# EAGLE design syncbox (EAGLE 9.2.2)
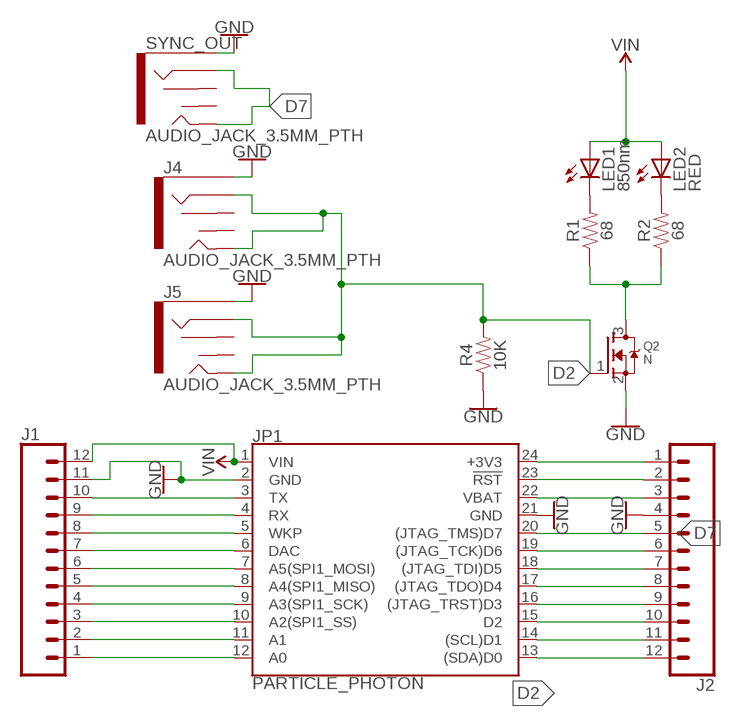
[diagram p0: schematic, sheet 1]

## Parts
J1  CONN_12  [1X12]
J2  CONN_12  [1X12]
J4  AUDIO_JACK_3.5MM_PTH  [AUDIO-JACK]
J5  AUDIO_JACK_3.5MM_PTH  [AUDIO-JACK]
JP1  PARTICLE_PHOTON  [PARTICLE_PHOTON]
LED1  850nm  LED5MM  [LED5MM]
LED2  RED  LED5MM  [LED5MM]
Q2  N  MOSFET-NWAVE  [SOT23-W]
R1  68  RESISTORAXIAL-0.3  [AXIAL-0.3]
R2  68  RESISTORAXIAL-0.3  [AXIAL-0.3]
R4  10K  RESISTORAXIAL-0.3  [AXIAL-0.3]
SYNC_OUT  AUDIO_JACK_3.5MM_PTH  [AUDIO-JACK]

## Nets
D2: J2.10 J4.RING J4.TIP J5.RING J5.TIP JP1.15(D2) Q2.1(G) R4.P$2
D7: J2.5 JP1.20((JTAG_TMS)D7) SYNC_OUT.RING SYNC_OUT.TIP
GND: J1.11 J2.4 J4.SLEEVE J5.SLEEVE JP1.2(GND) JP1.21(GND) Q2.2(S) R4.P$1 SYNC_OUT.SLEEVE
N$1: LED1.K(C) R1.P$2
N$2: LED2.K(C) R2.P$2
N$3: Q2.3(D) R1.P$1 R2.P$1
N$4: J1.10 JP1.3(TX)
N$5: J1.9 JP1.4(RX)
N$6: J2.12 JP1.13((SDA)D0)
N$7: J1.8 JP1.5(WKP)
N$8: J1.7 JP1.6(DAC)
N$9: J1.6 JP1.7(A5(SPI1_MOSI))
N$10: J1.5 JP1.8(A4(SPI1_MISO))
N$11: J1.4 JP1.9(A3(SPI1_SCK))
N$12: J1.3 JP1.10(A2(SPI1_SS))
N$13: J1.2 JP1.11(A1)
N$14: J1.1 JP1.12(A0)
N$15: J2.11 JP1.14((SCL)D1)
N$16: J2.9 JP1.16((JTAG_TRST)D3)
N$17: J2.8 JP1.17((JTAG_TDO)D4)
N$18: J2.7 JP1.18((JTAG_TDI)D5)
N$19: J2.6 JP1.19((JTAG_TCK)D6)
N$22: J2.3 JP1.22(VBAT)
N$23: J2.2 JP1.23(!RST!)
N$24: J2.1 JP1.24(+3V3)
VIN: J1.12 JP1.1(VIN) LED1.A LED2.A
Unconnected: J4.RSH J4.TSH J5.RSH J5.TSH SYNC_OUT.RSH SYNC_OUT.TSH

## Library data of the parts
J1 J2 = SparkFun-Connectors:CONN_12: Multi connection point. Often used as Generic Header-pin footprint for 0.1 inch spaced/style header connections On any of the 0.1 inch spaced packages, you can populate with these: Break Away Headers - Straight <https://www.sparkfun.com/products/116> (PRT-00116) Break Away Male Headers - Right Angle <https://www.sparkfun.com/products/553> (PRT-00553) Female Headers <https://www.sparkfun.com/products/115> (PRT-00115) Break Away Headers - Machine Pin <https://www.sparkfun.com/products/117> (PRT-00117) Break Away Female Headers - Swiss Machine Pin <https://www.sparkfun.com/products/743> (PRT-00743) For SCREWTERMINALS and SPRING TERMINALS visit here: Screw Terimnals on SparkFun.com <https://www.sparkfun.com/search/results?term=Screw+Terminals> (5mm/3.5mm/2.54mm spacing) This device is also useful as a general connection point to wire up your design to another part of your project. Our various solder wires solder well into these plated through hole pads. Hook-Up Wire - Assortment (Stranded, 22 AWG) <https://www.sparkfun.com/products/11375> (PRT-11375) Hook-Up Wire - Assortment (Solid Core, 22 AWG) <https://www.sparkfun.com/products/11367> (PRT-11367) View the entire wire category on our website here <https://www.sparkfun.com/categories/141> Special notes: Molex polarized connector foot print use with SKU : PRT-08231 with associated crimp pins and housings. 1MM SMD Version SKU: PRT-10208 NOTES ON THE VARIANTS LOCK and LOCK_LONGPADS... This footprint was designed to help hold the alignment of a through-hole component (i.e. 6-pin header) while soldering it into place. You may notice that each hole has been shifted either up or down by 0.005 of an inch from it's more standard position (which is a perfectly straight line). This slight alteration caused the pins (the squares in the middle) to touch the edges of the holes. Because they are alternating, it causes a "brace" to hold the component in place. 0.005 has proven to be the perfect amount of "off-center" position when using our standard breakaway headers. Although looks a little odd when you look at the bare footprint, once you have a header in there, the alteration is very hard to notice. Also,if you push a header all the way into place, it is covered up entirely on the bottom side.
J4 J5 SYNC_OUT = SparkFun-Connectors:AUDIO_JACK_3.5MM: Audio Jack 3.5mm variants of PTH and SMT stereo audio jack with bypass switches. SparkFun Products: SparkFun SparkPunk Sound Kit <[https://www.sparkfun.com/products/11177]> - PTH MP3 Trigger <https://www.sparkfun.com/products/13720> -3.5mm SMD SparkFun PicoBoard <https://www.sparkfun.com/products/11888>- 2.5mm SMD; PROD_ID: CONN-08774; SF_ID: PRT-08032
JP1 = SparkFun-Boards:PARTICLE_PHOTON: Particle Photon Footprint of the Particle Photon that is used as a basis for many Photon shields. SparkFun Products: Particle Photon <https://www.sparkfun.com/products/13764> SparkFun Photon ProtoShield <https://www.sparkfun.com/products/13598> SparkFun Photon micro OLED Shield <https://www.sparkfun.com/products/13628> SparkFun Photon IMU Shield <https://www.sparkfun.com/products/13629> SparkFun Photon Battery Shield <https://www.sparkfun.com/products/13626>
LED1 LED2 = adafruit:LED: LED OSRAM: - CHIPLED LG R971, LG N971, LY N971, LG Q971, LY Q971, LO R971, LY R971 LH N974, LH R974 LS Q976, LO Q976, LY Q976 LO Q996 - Hyper CHIPLED LW Q18S LB Q993, LB Q99A, LB R99A - SideLED LS A670, LO A670, LY A670, LG A670, LP A670 LB A673, LV A673, LT A673, LW A673 LH A674 LY A675 LS A676, LA A676, LO A676, LY A676, LW A676 LS A679, LY A679, LG A679 - Hyper Micro SIDELED® LS Y876, LA Y876, LO Y876, LY Y876 LT Y87S - SmartLED LW L88C, LW L88S LB L89C, LB L89S, LG L890 LS L89K, LO L89K, LY L89K LS L896, LA L896, LO L896, LY L896 - TOPLED LS T670, LO T670, LY T670, LG T670, LP T670 LSG T670, LSP T670, LSY T670, LOP T670, LYG T670 LG T671, LOG T671, LSG T671 LB T673, LV T673, LT T673, LW T673 LH T674 LS T676, LA T676, LO T676, LY T676, LB T676, LH T676, LSB T676, LW T676 LB T67C, LV T67C, LT T67C, LS T67K, LO T67K, LY T67K, LW E67C LS E67B, LA E67B, LO E67B, LY E67B, LB E67C, LV E67C, LT E67C LW T67C LS T679, LY T679, LG T679 LS T770, LO T770, LY T770, LG T770, LP T770 LB T773, LV T773, LT T773, LW T773 LH T774 LS E675, LA E675, LY E675, LS T675 LS T776, LA T776, LO T776, LY T776, LB T776 LHGB T686 LT T68C, LB T68C - Hyper Mini TOPLED® LB M676 - Mini TOPLED Santana® LG M470 LS M47K, LO M47K, LY M47K Source: http://www.osram.convergy.de/
Q2 = adafruit:MOSFET-N: N-Channel Mosfet 2N7002E - 60V 260mA SOT23 [Digikey: 2N7002ET1GOSTR-ND] - REEL BSH103 - 30V 850mA SOT23 [Digikey: 568-5013-1-ND]
R1 R2 R4 = SparkFun-Resistors:RESISTOR: Generic Resistor Package

## Net classes
0 default: width 0.254 mm

## Board
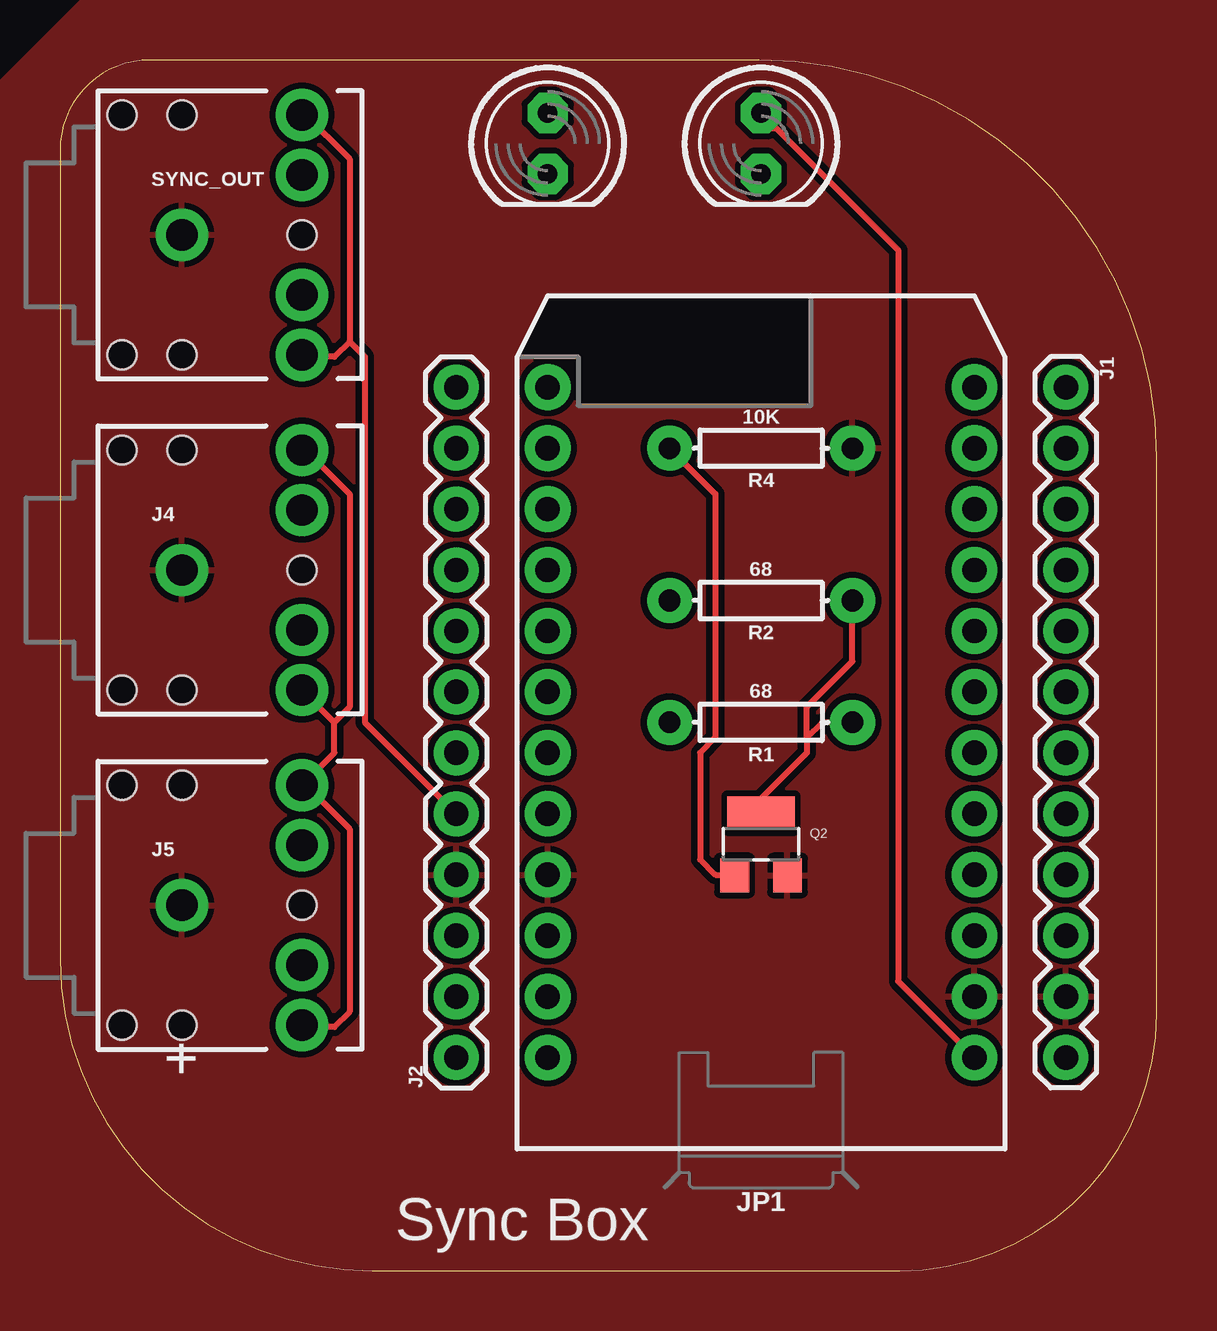
[diagram p1: board, top side]
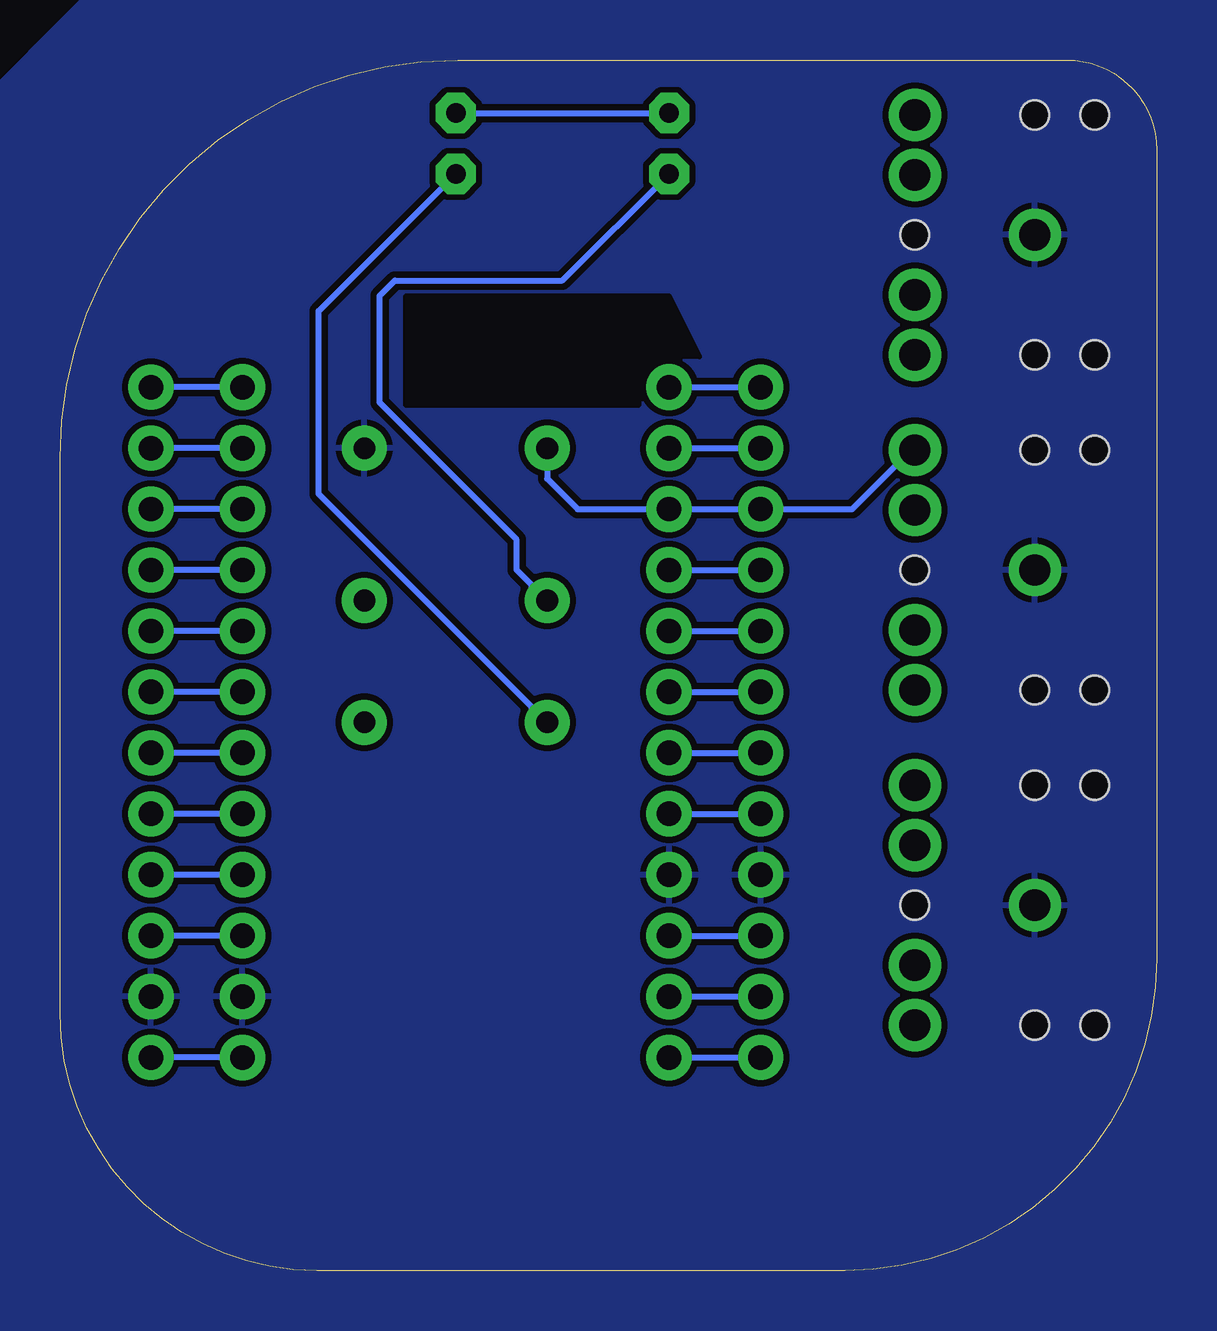
[diagram p2: board, bottom side, seen from below]

Size 45.7 x 50.47 mm. Coordinates in mm from the lower left corner, seen from the top.
Outline: 45.7,10.72 45.7,33.91 arc90 29.14,50.47 3.76,50.47 arc90 0,46.72 0,13.01 arc90 13.01,0 34.98,0 arc90 45.7,10.72
Copper layers (1*16): Top 0.035mm / dielectric 1.5mm / Bottom 0.035mm
Design rules "Voltera_DRC": minimum track width 10mil, minimum drill 0.6mm, track to track 10mil, track to pad 10mil, pad to pad 0.6mm, via to via 0.6mm, smd to smd 0mil, copper to edge 0mil, drill to drill 0.8mm, minimum pad ring 0.2mm, minimum via ring 0.2mm, stop-mask expansion 4mil, vias tented up to drill 0mil, thermal gap 10mil

### Footprints (pad centres in the part's own frame; a part is rotated, then mirrored left to right if it is on the bottom)
1X12 = drill 1.016 pad 1.88: 1 0,0; 2 2.54,0; 3 5.08,0; 4 7.62,0; 5 10.16,0; 6 12.7,0; 7 15.24,0; 8 17.78,0; 9 20.32,0; 10 22.86,0; 11 25.4,0; 12 27.94,0
AUDIO-JACK = drill 1.3 pad 2.184: RING 5,5; RSH 5,2.5; SLEEVE 0,0; TIP 5,-5; TSH 5,-2.5 | hole 1.2: 0,5; -2.5,5; -2.5,-5; 0,-5; 5,0
PARTICLE_PHOTON = drill 1.016 pad 1.905: 1 -8.89,13.97; 2 -8.89,11.43; 3 -8.89,8.89; 4 -8.89,6.35; 5 -8.89,3.81; 6 -8.89,1.27; 7 -8.89,-1.27; 8 -8.89,-3.81; 9 -8.89,-6.35; 10 -8.89,-8.89; 11 -8.89,-11.43; 12 -8.89,-13.97; 13 8.89,-13.97; 14 8.89,-11.43; 15 8.89,-8.89; 16 8.89,-6.35; 17 8.89,-3.81; 18 8.89,-1.27; 19 8.89,1.27; 20 8.89,3.81; 21 8.89,6.35; 22 8.89,8.89; 23 8.89,11.43; 24 8.89,13.97
LED5MM = drill 0.813 pad 1.676 octagon: A -1.27,0; K 1.27,0
SOT23-W = smd 1.2 x 1.4: 1 -1.1,-1.3; 2 1.1,-1.3 | smd 2.8 x 1.4: 3 0,1.3
AXIAL-0.3 = drill 0.9 pad 1.88: P$1 -3.81,0; P$2 3.81,0

### Placement (x,y rotation side)
J1  41.91,36.83 270 top
J2  16.51,8.89 90 top
J4  5.08,29.21 0 top
J5  5.08,15.24 0 top
JP1  29.21,22.86 180 top
LED1  29.21,46.99 270 top
LED2  20.32,46.99 270 top
Q2  29.21,17.78 0 top
R1  29.21,22.86 180 top
R2  29.21,27.94 180 top
R4  29.21,34.29 180 top
SYNC_OUT  5.08,43.18 0 top

### Tracks (layer width: path | path; a pad name or v marks a point on that pad's centre or on a via)
D2
  Top 0.254: 10.79,19.68 10.16,20.32 J5.RING 10.79,19.68 | 10.79,19.68 12.06,18.41 12.06,10.79 11.43,10.16 10.16,10.16 J5.TIP | 11.43,22.86 J4.TIP | 11.43,22.86 11.43,21.59 10.79,20.95 10.79,19.68 | R4.P$2 25.4,33.66 26.03,33.66 27.3,32.38 27.3,22.22 26.67,21.59 26.67,17.14 27.3,16.51 27.94,16.51 Q2.1 | 11.43,22.86 12.06,23.49 12.06,32.38 10.16,34.29 J4.RING
  Bottom 0.254: J4.RING 10.16,33.66 10.79,33.66 12.7,31.75 J2.10 JP1.15 24.13,31.75 25.4,33.02 R4.P$2
D7
  Top 0.254: 12.06,38.73 11.43,38.1 10.16,38.1 SYNC_OUT.TIP | 12.06,38.73 12.06,46.36 10.16,48.26 SYNC_OUT.RING | J2.5 12.7,22.86 12.7,38.1 12.06,38.73
  Bottom 0.254: JP1.20 J2.5
GND
  pour Top: 1.27,53.34 49.53,53.34 49.53,-2.54 -6.35,-2.54 -7.62,-1.27 -7.62,44.45
  pour Bottom: -8.89,-3.81 -8.89,42.65 arc-90 4.34,55.88 41.91,55.88 52.07,45.72 52.07,-2.54 50.8,-3.81
N$1
  Bottom 0.254: LED1.K 34.93,40.01 34.93,32.38 26.03,23.49 26.03,22.86 R1.P$2
N$2
  Bottom 0.254: LED2.K 24.77,41.28 31.75,41.28 32.39,40.64 32.39,36.2 26.67,30.48 26.67,29.21 26.03,28.57 26.03,27.94 R2.P$2
N$3
  Top 0.254: 31.12,22.22 31.12,21.59 29.21,19.68 Q2.3 | 31.12,22.22 31.75,22.86 R1.P$1 | R2.P$1 33.02,25.4 31.12,23.49 31.12,22.22
N$4
  Bottom 0.254: JP1.3 J1.10
N$5
  Bottom 0.254: JP1.4 J1.9
N$6
  Bottom 0.254: JP1.13 J2.12
N$7
  Bottom 0.254: JP1.5 J1.8
N$8
  Bottom 0.254: JP1.6 J1.7
N$9
  Bottom 0.254: JP1.7 J1.6
N$10
  Bottom 0.254: JP1.8 J1.5
N$11
  Bottom 0.254: JP1.9 J1.4
N$12
  Bottom 0.254: JP1.10 J1.3
N$13
  Bottom 0.254: JP1.11 J1.2
N$14
  Bottom 0.254: JP1.12 J1.1
N$15
  Bottom 0.254: JP1.14 J2.11
N$16
  Bottom 0.254: JP1.16 J2.9
N$17
  Bottom 0.254: JP1.17 J2.8
N$18
  Bottom 0.254: JP1.18 J2.7
N$19
  Bottom 0.254: JP1.19 J2.6
N$22
  Bottom 0.254: JP1.22 J2.3
N$23
  Bottom 0.254: JP1.23 J2.2
N$24
  Bottom 0.254: JP1.24 J2.1
VIN
  Top 0.254: JP1.1 34.93,12.07 34.93,42.55 29.84,47.62 29.21,47.62 LED1.A
  Bottom 0.254: JP1.1 J1.12 | LED1.A LED2.A

### Text on the board
tPlace: + | +
tNames: Sync Box